# EAGLE schematic Tdog v0.9 (EAGLE 6.3)
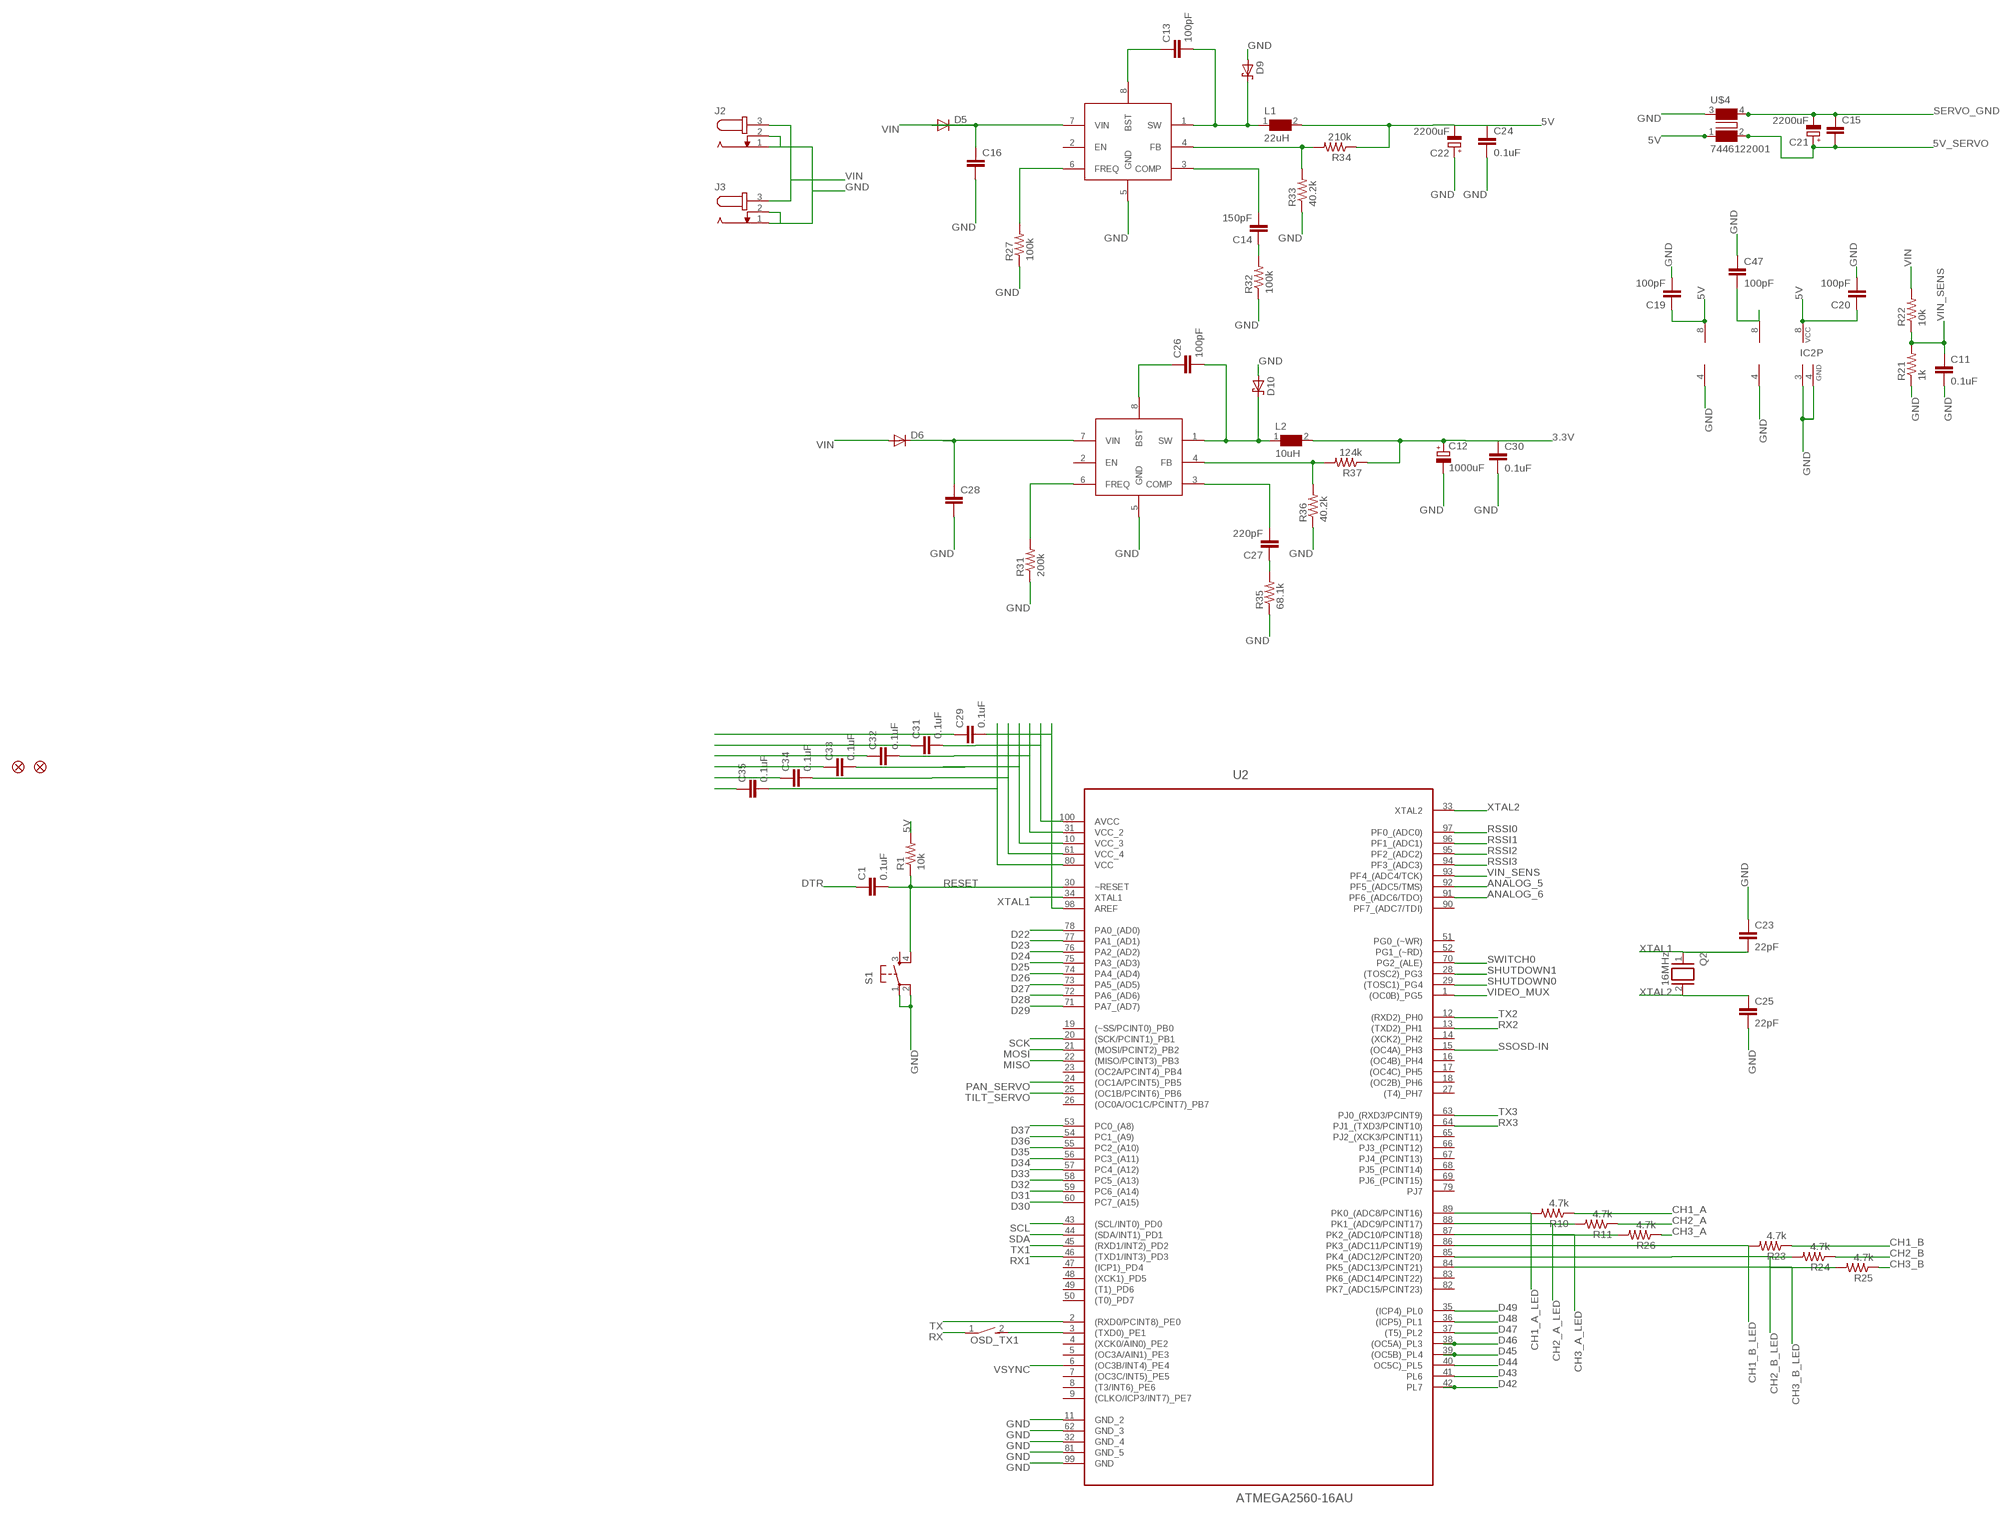
[diagram p0: schematic, sheet 1, part 1 of 3]
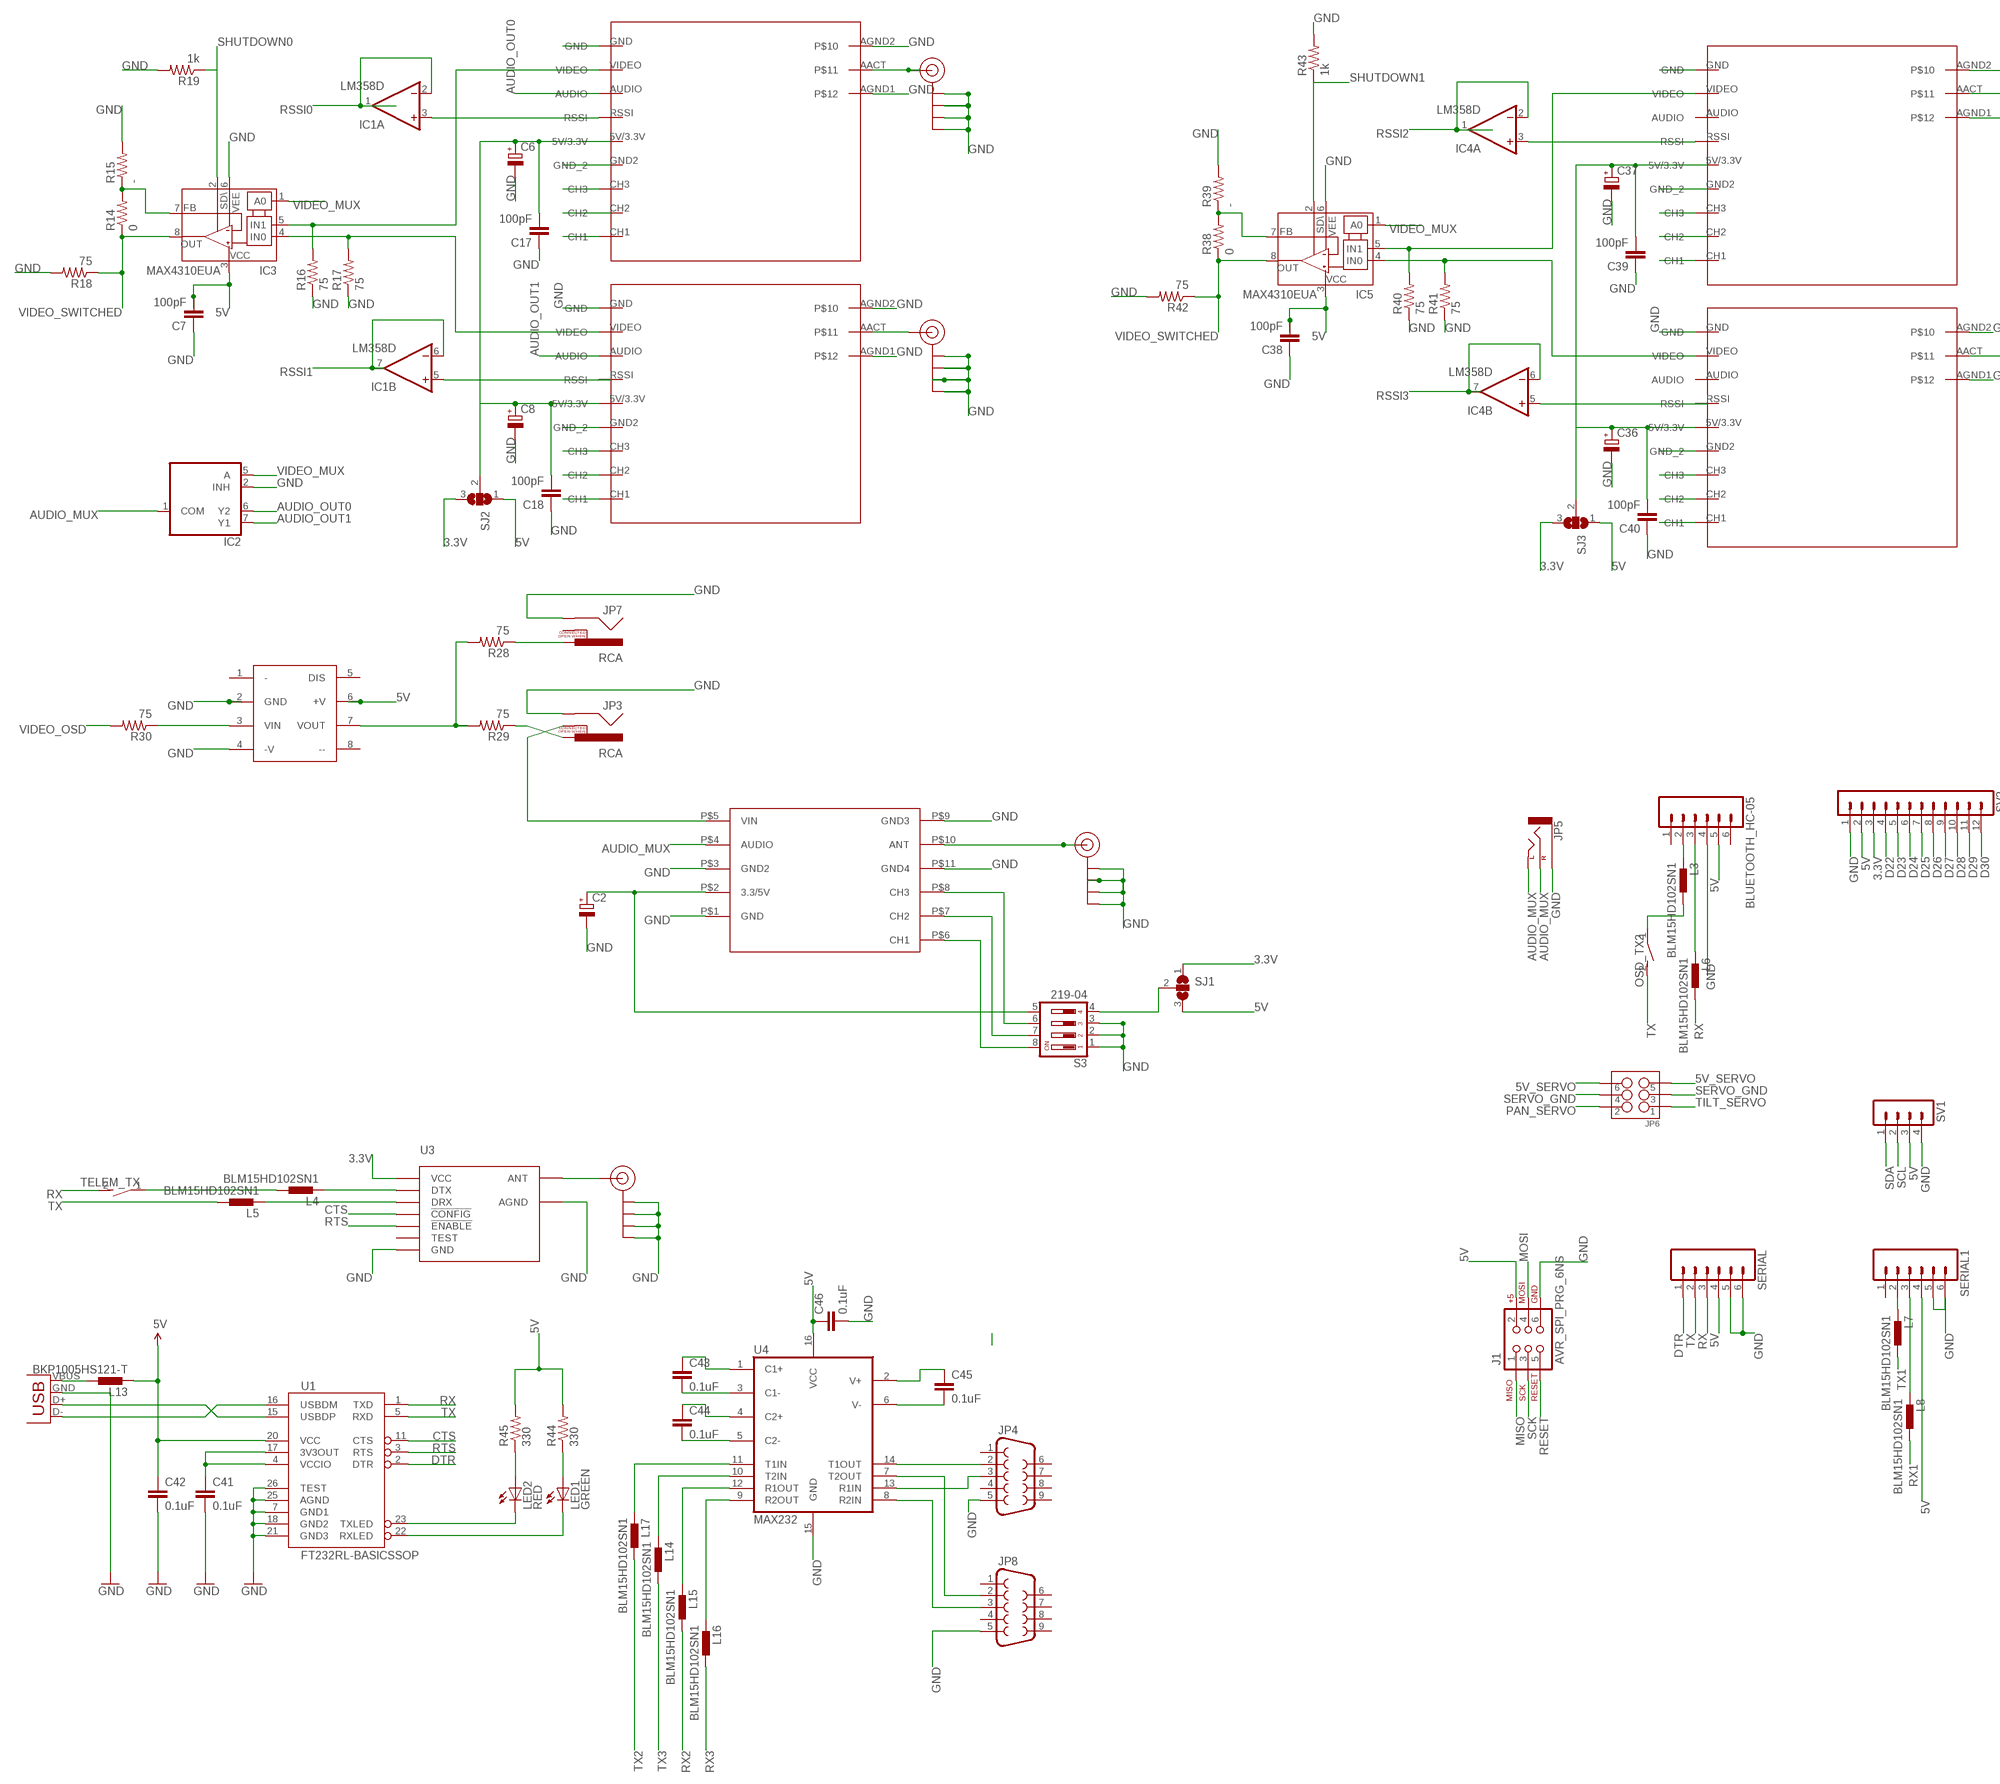
[diagram p1: schematic, sheet 1, part 2 of 3]
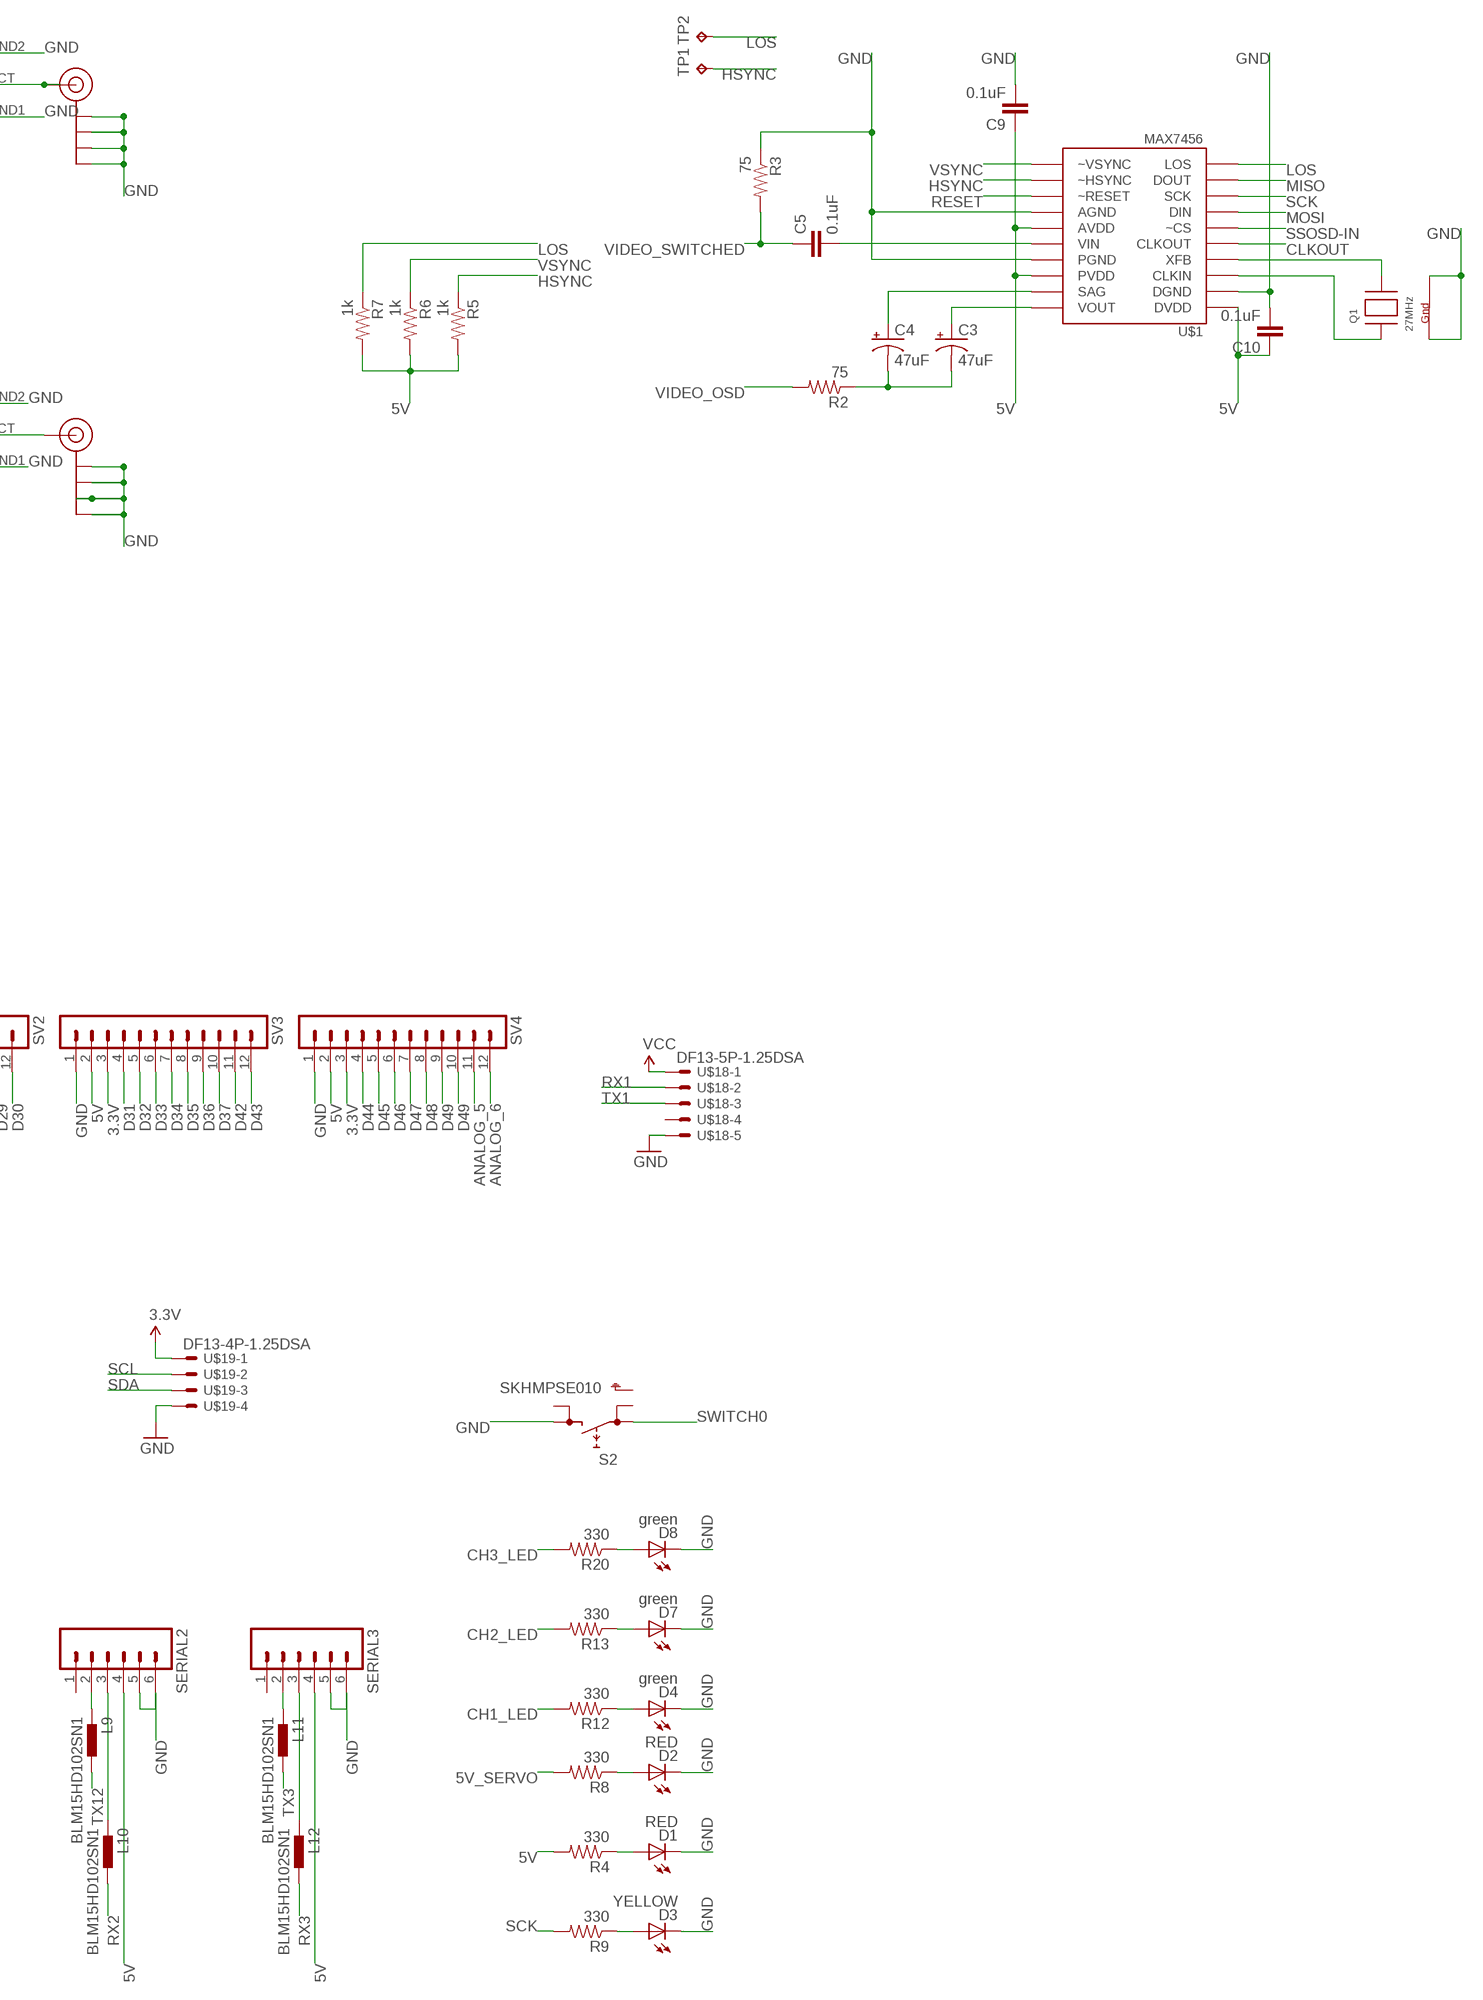
[diagram p2: schematic, sheet 1, part 3 of 3]

## Parts
BLUETOOTH_HC-05  M06SIP  [1X06]
C1  0.1uF  CAP0402-CAP  [0402-CAP]
C2  CPOL-EUE3.5-10  [E3,5-10]
C3  47uF  CAP_POL3528  [EIA3528]
C4  47uF  CAP_POL3528  [EIA3528]
C5  0.1uF  CAP0402-CAP  [0402-CAP]
C6  CPOL-EUE3.5-10  [E3,5-10]
C7  100pF  CAP0402-CAP  [0402-CAP]
C8  CPOL-EUE3.5-10  [E3,5-10]
C9  0.1uF  CAP0402-CAP  [0402-CAP]
C10  0.1uF  CAP0402-CAP  [0402-CAP]
C11  0.1uF  CAP0402-CAP  [0402-CAP]
C12  1000uF  CPOL-EUE5-10.5  [E5-10,5]
C13  100pF  CAP0402-CAP  [0402-CAP]
C14  150pF  CAP0402-CAP  [0402-CAP]
C15  C-EUC1206  [C1206]
C16  C-EUC1206  [C1206]
C17  100pF  CAP0402-CAP  [0402-CAP]
C18  100pF  CAP0402-CAP  [0402-CAP]
C19  100pF  CAP0402-CAP  [0402-CAP]
C20  100pF  CAP0402-CAP  [0402-CAP]
C21  2200uF  CPOL-EUE7.5-16  [E7,5-16]
C22  2200uF  CPOL-EUE7.5-16  [E7,5-16]
C23  22pF  CAP0402-CAP  [0402-CAP]
C24  0.1uF  CAP0402-CAP  [0402-CAP]
C25  22pF  CAP0402-CAP  [0402-CAP]
C26  100pF  CAP0402-CAP  [0402-CAP]
C27  220pF  CAP0402-CAP  [0402-CAP]
C28  C-EUC1206  [C1206]
C29  0.1uF  CAP0402-CAP  [0402-CAP]
C30  0.1uF  CAP0402-CAP  [0402-CAP]
C31  0.1uF  CAP0402-CAP  [0402-CAP]
C32  o.1uF  CAP0402-CAP  [0402-CAP]
C33  0.1uF  CAP0402-CAP  [0402-CAP]
C34  0.1uF  CAP0402-CAP  [0402-CAP]
C35  0.1uF  CAP0402-CAP  [0402-CAP]
C36  CPOL-EUE3.5-10  [E3,5-10]
C37  CPOL-EUE3.5-10  [E3,5-10]
C38  100pF  CAP0402-CAP  [0402-CAP]
C39  100pF  CAP0402-CAP  [0402-CAP]
C40  100pF  CAP0402-CAP  [0402-CAP]
C41  0.1uF  CAP0402-CAP  [0402-CAP]
C42  0.1uF  CAP0402-CAP  [0402-CAP]
C43  0.1uF  CAP0402-CAP  [0402-CAP]
C44  0.1uF  CAP0402-CAP  [0402-CAP]
C45  0.1uF  CAP0402-CAP  [0402-CAP]
C46  0.1uF  CAP0402-CAP  [0402-CAP]
C47  100pF  CAP0402-CAP  [0402-CAP]
D1  RED  LED0603  [LED-0603]
D2  RED  LED0603  [LED-0603]
D3  YELLOW  LED0603  [LED-0603]
D4  green  LED0603  [LED-0603]
D5  DIODE-DO214AA  [DO214AA]
D6  DIODE-DO214AA  [DO214AA]
D7  green  LED0603  [LED-0603]
D8  green  LED0603  [LED-0603]
D9  SCHOTTKY-DIODESMD  [SMB]
D10  SCHOTTKY-DIODESMD  [SMB]
IC1  LM358D  [SO08]
IC2  741G53DCT  [DCT_R-PDSO-G8]
IC3  MAX4310EUA  [SO08]
IC4  LM358D  [SO08]
IC5  MAX4310EUA  [SO08]
J1  AVR_SPI_PRG_6NS  [2X3-NS]
J2  JACK-PLUG1  [SPC4078]
J3  JACK-PLUG1  [SPC4078]
J$1  SMA_EDGE  [SMA-EDGE]
J$2  SMA_EDGE  [SMA-EDGE]
J$3  SMA_EDGE  [SMA-EDGE]
J$4  SMA_EDGE  [SMA-EDGE]
J$5  SMA_EDGE  [SMA-EDGE]
J$6  SMA_EDGE  [SMA-EDGE]
JP1  FIDUCIAL1X2  [FIDUCIAL-1X2]
JP2  FIDUCIAL1X2  [FIDUCIAL-1X2]
JP3  RCA  [RCA]
JP4  F09H  [F09H]
JP5  AUDIO-JACK1:1  [STEREOJACK2.5MM]
JP6  M03X2NO_SILK  [2X3-NS]
JP7  RCA  [RCA]
JP8  F09H  [F09H]
L1  22uH  WE-PD-744770112_1260/1245/1280/1210  [WE-PD_1260/1245/1280/1210]
L2  10uH  WE-PD-744770112_1260/1245/1280/1210  [WE-PD_1260/1245/1280/1210]
L3  BLM15HD102SN1  INDUCTOR-0402  [0402-IND]
L4  BLM15HD102SN1  INDUCTOR-0402  [0402-IND]
L5  BLM15HD102SN1  INDUCTOR-0402  [0402-IND]
L6  BLM15HD102SN1  INDUCTOR-0402  [0402-IND]
L7  BLM15HD102SN1  INDUCTOR-0402  [0402-IND]
L8  BLM15HD102SN1  INDUCTOR-0402  [0402-IND]
L9  BLM15HD102SN1  INDUCTOR-0402  [0402-IND]
L10  BLM15HD102SN1  INDUCTOR-0402  [0402-IND]
L11  BLM15HD102SN1  INDUCTOR-0402  [0402-IND]
L12  BLM15HD102SN1  INDUCTOR-0402  [0402-IND]
L13  BKP1005HS121-T  INDUCTOR-0402  [0402-IND]
L14  BLM15HD102SN1  INDUCTOR-0402  [0402-IND]
L15  BLM15HD102SN1  INDUCTOR-0402  [0402-IND]
L16  BLM15HD102SN1  INDUCTOR-0402  [0402-IND]
L17  BLM15HD102SN1  INDUCTOR-0402  [0402-IND]
LED1  GREEN  LED0603  [LED-0603]
LED2  RED  LED0603  [LED-0603]
OPA693  OPA693  [OPA693]
OSD_TX1  DS01E  [DS-01]
OSD_TX2  DS01E  [DS-01]
Q1  27MHz  XTAL-4-3225  [NX3225]
Q2  16MHz  XTAL/S  [QS]
R1  10k  RESISTOR0402-RES  [0402-RES]
R2  75  RESISTOR0402-RES  [0402-RES]
R3  75  RESISTOR0402-RES  [0402-RES]
R4  330  RESISTOR0402-RES  [0402-RES]
R5  1k  RESISTOR0402-RES  [0402-RES]
R6  1k  RESISTOR0402-RES  [0402-RES]
R7  1k  RESISTOR0402-RES  [0402-RES]
R8  330  RESISTOR0402-RES  [0402-RES]
R9  330  RESISTOR0402-RES  [0402-RES]
R10  4.7k  RESISTOR0402-RES  [0402-RES]
R11  4.7k  RESISTOR0402-RES  [0402-RES]
R12  330  RESISTOR0402-RES  [0402-RES]
R13  330  RESISTOR0402-RES  [0402-RES]
R14  0  RESISTOR0402-RES  [0402-RES]
R15  -  RESISTOR0402-RES  [0402-RES]
R16  75  RESISTOR0402-RES  [0402-RES]
R17  75  RESISTOR0402-RES  [0402-RES]
R18  75  RESISTOR0402-RES  [0402-RES]
R19  1k  RESISTOR0402-RES  [0402-RES]
R20  330  RESISTOR0402-RES  [0402-RES]
R21  1k  RESISTOR0402-RES  [0402-RES]
R22  10k  RESISTOR0402-RES  [0402-RES]
R23  4.7k  RESISTOR0402-RES  [0402-RES]
R24  4.7k  RESISTOR0402-RES  [0402-RES]
R25  4.7k  RESISTOR0402-RES  [0402-RES]
R26  4.7k  RESISTOR0402-RES  [0402-RES]
R27  100k  RESISTOR0402-RES  [0402-RES]
R28  75  RESISTOR0402-RES  [0402-RES]
R29  75  RESISTOR0402-RES  [0402-RES]
R30  75  RESISTOR0402-RES  [0402-RES]
R31  200k  RESISTOR0402-RES  [0402-RES]
R32  100k  RESISTOR0402-RES  [0402-RES]
R33  40.2k  RESISTOR0402-RES  [0402-RES]
R34  210k  RESISTOR0402-RES  [0402-RES]
R35  68.1k  RESISTOR0402-RES  [0402-RES]
R36  40.2k  RESISTOR0402-RES  [0402-RES]
R37  124k  RESISTOR0402-RES  [0402-RES]
R38  0  RESISTOR0402-RES  [0402-RES]
R39  -  RESISTOR0402-RES  [0402-RES]
R40  75  RESISTOR0402-RES  [0402-RES]
R41  75  RESISTOR0402-RES  [0402-RES]
R42  75  RESISTOR0402-RES  [0402-RES]
R43  1k  RESISTOR0402-RES  [0402-RES]
R44  330  RESISTOR0402-RES  [0402-RES]
R45  330  RESISTOR0402-RES  [0402-RES]
S1  TAC_SWITCHSMD  [TACTILE_SWITCH_SMD]
S2  SKHMPSE010  [SKHMPXE010]
S3  219-04  [CTS-219-04]
SERIAL  M06SIP  [1X06]
SERIAL1  M06SIP  [1X06]
SERIAL2  M06SIP  [1X06]
SERIAL3  M06SIP  [1X06]
SJ1  SJ2WW  [SJ_2W]
SJ2  SJ2WW  [SJ_2W]
SJ3  SJ2WW  [SJ_2W]
SV1  MA04-1  [MA04-1]
SV2  MA12-1  [MA12-1]
SV3  MA12-1  [MA12-1]
SV4  MA12-1  [MA12-1]
TELEM_TX  DS01E  [DS-01]
TP1  TPTP12SQ  [TP12SQ]
TP2  TPTP12SQ  [TP12SQ]
U1  FT232RL-BASICSSOP  [SSOP28DB]
U2  ATMEGA2560-16AU  [QFP50P1600X1600X120-100N]
U3  HM-TRPSMD  [HM-TRP-SMD]
U4  MAX232  MAX232SOIC16  [SO016]
U$1  MAX7456  [TSSOP28]
U$2  MP1584  [MP1584]
U$3  TX5813  [TX5813]
U$4  7446122001  [WE-LF_622/MV]
U$5  MP1584  [MP1584]
U$6  BOSCMARX5808  [BOSCAMRX5808]
U$7  BOSCMARX5808  [BOSCAMRX5808]
U$8  BOSCMARX5808  [BOSCAMRX5808]
U$10  BOSCMARX5808  [BOSCAMRX5808]
U$18  DF13-5P-1.25DSA  [DF13-5P-1.25DSA]
U$19  DF13-4P-1.25DSA  [DF13-4P-1.25DSA]
X1  USB-A-H  [USB-A-H]

## Nets
1: C36.+ C37.+ C39.2 C40.2 SJ3.2
3.3V: C12.+ C30.1 L2.2 R37.1 SJ1.1 SJ2.3 SJ3.3 SV2.3 SV3.3 SV4.3 U3.VCC U$19.1
5V: BLUETOOTH_HC-05.5 C7.2 C9.1 C10.1 C19.1 C20.1 C22.- C24.1 C29.2 C31.2 C32.2 C33.2 C34.2 C35.2 C38.2 C42.1 C46.1 C47.2 IC1.8(P:V+) IC2.8(VCC) IC3.3(V+) IC4.8(P:V+) IC5.3(V+) J1.2 L1.2 L13.P$2 OPA693.6(+V) R1.2 R4.2 R5.2 R6.2 R7.2 R34.1 R44.2 R45.2 SERIAL1.4 SERIAL2.4 SERIAL3.4 SERIAL.4 SJ1.3 SJ2.1 SJ3.1 SV1.3 SV2.2 SV3.2 SV4.2 U1.20(VCC) U2.10(VCC_3) U2.31(VCC_2) U2.61(VCC_4) U2.80(VCC) U2.98(AREF) U2.100(AVCC) U4.16(VCC) U$1.3(DVDD) U$1.21(AVDD) U$1.24(PVDD) U$4.1
5V_SERVO: C15.2 C21.+ JP6.5 JP6.6 R8.2 U$4.2
66676: C6.+ C8.+ C17.2 C18.2 SJ2.2
ANALOG_5: SV4.11 U2.92(PF5_(ADC5/TMS))
ANALOG_6: SV4.12 U2.91(PF6_(ADC6/TDO))
AUDIO_MUX: IC2.1(COM) JP5.1(LEFT) JP5.4(RIGHT) U$3.P$4(AUDIO)
AUDIO_OUT0: IC2.6(Y2)
AUDIO_OUT1: IC2.7(Y1)
CH1_A: R10.1
CH1_A_LED: R10.2 U2.89(PK0_(ADC8/PCINT16))
CH1_B: R23.1
CH1_B_LED: R23.2 U2.86(PK3_(ADC11/PCINT19))
CH1_LED: R12.2
CH2_A: R11.1
CH2_A_LED: R11.2 U2.88(PK1_(ADC9/PCINT17))
CH2_B: R24.1
CH2_B_LED: R24.2 U2.85(PK4_(ADC12/PCINT20))
CH2_LED: R13.2
CH3_A: R26.1
CH3_A_LED: R26.2 U2.87(PK2_(ADC10/PCINT18))
CH3_B: R25.1
CH3_B_LED: R25.2 U2.84(PK5_(ADC13/PCINT21))
CH3_LED: R20.2
CLKOUT: U$1.7(CLKOUT)
CTS: U1.11(CTS) U3.!CONFIG
D22: SV2.4 U2.78(PA0_(AD0))
D23: SV2.5 U2.77(PA1_(AD1))
D24: SV2.6 U2.76(PA2_(AD2))
D25: SV2.7 U2.75(PA3_(AD3))
D26: SV2.8 U2.74(PA4_(AD4))
D27: SV2.9 U2.73(PA5_(AD5))
D28: SV2.10 U2.72(PA6_(AD6))
D29: SV2.11 U2.71(PA7_(AD7))
D30: SV2.12 U2.60(PC7_(A15))
D31: SV3.4 U2.59(PC6_(A14))
D32: SV3.5 U2.58(PC5_(A13))
D33: SV3.6 U2.57(PC4_(A12))
D34: SV3.7 U2.56(PC3_(A11))
D35: SV3.8 U2.55(PC2_(A10))
D36: SV3.9 U2.54(PC1_(A9))
D37: SV3.10 U2.53(PC0_(A8))
D42: SV3.11 U2.42(PL7)
D43: SV3.12 U2.41(PL6)
D44: SV4.4 U2.40(OC5C)_PL5)
D45: SV4.5 U2.39((OC5B)_PL4)
D46: SV4.6 U2.38((OC5A)_PL3)
D47: SV4.7 U2.37((T5)_PL2)
D48: SV4.8 U2.36((ICP5)_PL1)
D49: SV4.9 SV4.10 U2.35((ICP4)_PL0)
DSFSA: C16.1 D5.C U$2.7(VIN)
DSFSA1: C28.1 D6.C U$5.7(VIN)
DTR: C1.1 SERIAL.1 U1.2(DTR)
GND: BLUETOOTH_HC-05.4 C2.- C6.- C7.1 C8.- C9.2 C10.2 C11.2 C12.- C16.2 C17.1 C18.1 C19.2 C20.2 C22.+ C23.1 C24.2 C25.2 C28.2 C29.1 C30.2 C31.1 C32.1 C33.1 C34.1 C35.1 C36.- C37.- C38.1 C39.1 C40.1 C41.2 C42.2 C46.2 C47.1 D1.C D2.C D3.C D4.C D7.C D8.C D9.A D10.A IC1.4(P:V-) IC2.2(INH) IC2.3(GND) IC2.4(GND) IC3.6(V-) IC4.4(P:V-) IC5.6(V-) J1.6 J2.1 J2.2 J3.1 J3.2 J$1.GND@0(GND) J$1.GND@1(GND) J$1.GND@2(GND) J$1.GND@3(GND) J$2.GND@0(GND) J$2.GND@1(GND) J$2.GND@2(GND) J$2.GND@3(GND) J$3.GND@0(GND) J$3.GND@1(GND) J$3.GND@2(GND) J$3.GND@3(GND) J$4.GND@0(GND) J$4.GND@1(GND) J$4.GND@2(GND) J$4.GND@3(GND) J$5.GND@0(GND) J$5.GND@1(GND) J$5.GND@2(GND) J$5.GND@3(GND) J$6.GND@0(GND) J$6.GND@1(GND) J$6.GND@2(GND) J$6.GND@3(GND) JP3.SHELL JP4.5 JP5.5(SLEEVE) JP7.SHELL JP8.5 OPA693.2(GND) OPA693.4(-V) Q1.2(G1) Q1.4(G2) R3.1 R15.2 R16.1 R17.1 R18.2 R19.2 R21.1 R27.1 R31.1 R32.1 R33.1 R35.1 R36.1 R39.2 R40.1 R41.1 R42.2 R43.2 S1.1 S1.2 S2.3(2.1) S3.1 S3.2 S3.3 SERIAL1.5 SERIAL1.6 SERIAL2.5 SERIAL2.6 SERIAL3.5 SERIAL3.6 SERIAL.5 SERIAL.6 SV1.4 SV2.1 SV3.1 SV4.1 U1.7(GND1) U1.18(GND2) U1.21(GND3) U1.25(AGND) U1.26(TEST) U2.11(GND_2) U2.32(GND_4) U2.62(GND_3) U2.81(GND_5) U2.99(GND) U3.AGND U3.GND U4.15(GND) U$1.4(DGND) U$1.20(AGND) U$1.23(PGND) U$2.5(GND) U$3.P$1(GND) U$3.P$3(GND2) U$3.P$9(GND3) U$3.P$11(GND4) U$4.3 U$5.5(GND) U$6.AGND1 U$6.AGND2 U$7.AGND1 U$7.AGND2 U$8.AGND1 U$8.AGND2 U$10.AGND1 U$10.AGND2 U$18.5 U$19.4 X1.GND(VBUS)
HSYNC: R5.1 TP1.TP U$1.18(~HSYNC)
LOS: R7.1 TP2.TP U$1.12(LOS)
MISO: J1.1 U2.22((MISO/PCINT3)_PB3) U$1.11(DOUT)
MOSI: J1.4 U2.21((MOSI/PCINT2)_PB2) U$1.9(DIN)
N$1: Q1.3(X2) U$1.6(XFB)
N$2: BLUETOOTH_HC-05.2 L3.P$2
N$3: BLUETOOTH_HC-05.3 L6.P$2
N$4: L7.P$2 SERIAL1.2
N$5: Q1.1(X1) U$1.5(CLKIN)
N$6: C3.A(+) U$1.26(VOUT)
N$7: C4.A(+) U$1.25(SAG)
N$8: C3.C(-) C4.C(-) R2.1
N$9: C5.2 U$1.22(VIN)
N$10: D1.A R4.1
N$11: D2.A R8.1
N$12: D8.A R20.1
N$13: D3.A R9.1
N$14: R31.2 U$5.6(FREQ)
N$15: JP3.PIN R29.1
N$16: S3.4 SJ1.2
N$17: R27.2 U$2.6(FREQ)
N$18: IC1.5(B:+IN)
N$19: J$3.SIG(SIGNAL) U$7.AACT
N$20: IC1.3(A:+IN)
N$21: C13.1 U$2.8(BST)
N$22: OPA693.3(VIN) R30.1
N$23: IC3.4(IN0) R17.2
N$24: OSD_TX1.2 U2.3((TXD0)_PE1)
N$25: IC3.7(FB) R14.2 R15.1
N$26: C26.1 U$5.8(BST)
N$27: OPA693.7(VOUT) R28.2 R29.2
N$28: C2.+ S3.5 U$3.P$2(3.3/5V)
N$29: J$2.SIG(SIGNAL) U$10.AACT
N$30: R33.2 R34.2 U$2.4(FB)
N$31: C14.2 U$2.3(COMP)
N$32: R36.2 R37.2 U$5.4(FB)
N$33: J$4.SIG(SIGNAL) U$3.P$10(ANT)
N$34: C14.1 R32.2
N$35: IC3.5(IN1) R16.2
N$36: IC4.5(B:+IN)
N$37: C27.2 U$5.3(COMP)
N$38: S3.6 U$3.P$8(CH3)
N$39: S3.7 U$3.P$7(CH2)
N$40: S3.8 U$3.P$6(CH1)
N$41: D4.A R12.1
N$42: D7.A R13.1
N$43: C27.1 R35.2
N$44: C26.2 D10.C L2.1 U$5.1(SW)
N$45: JP7.PIN R28.1
N$46: IC4.3(A:+IN)
N$47: C13.2 D9.C L1.1 U$2.1(SW)
N$48: IC5.4(IN0) R41.2
N$49: IC5.5(IN1) R40.2
N$50: IC5.7(FB) R38.2 R39.1
N$51: J$1.SIG(SIGNAL) U3.ANT
N$52: L4.P$1 TELEM_TX.1
N$53: L9.P$2 SERIAL2.2
N$54: J$6.SIG(SIGNAL) U$6.AACT
N$55: J$5.SIG(SIGNAL) U$8.AACT
N$56: L10.P$2 SERIAL2.3
N$57: L8.P$2 SERIAL1.3
N$58: L11.P$2 SERIAL3.2
N$59: L4.P$2 U3.DTX
N$60: L5.P$2 U3.DRX
N$61: L12.P$2 SERIAL3.3
N$62: C41.1 U1.4(VCCIO) U1.17(3V3OUT)
N$63: U1.15(USBDP) X1.D+(D-)
N$64: U1.16(USBDM) X1.D-(D+)
N$65: LED2.A R45.1
N$66: LED1.A R44.1
N$67: LED2.C U1.23(TXLED)
N$68: LED1.C U1.22(RXLED)
N$69: L13.P$1 X1.VBUS(GND)
N$70: L3.P$1 OSD_TX2.1
N$71: C45.1 U4.2(V+)
N$72: C45.2 U4.6(V-)
N$73: C44.1 U4.4(C2+)
N$74: C44.2 U4.5(C2-)
N$75: C43.1 U4.1(C1+)
N$76: JP4.3 U4.13(R1IN)
N$77: JP4.2 U4.14(T1OUT)
N$78: C43.2 U4.3(C1-)
N$80: L17.P$2 U4.11(T1IN)
N$81: L14.P$2 U4.10(T2IN)
N$82: L15.P$2 U4.12(R1OUT)
N$83: L16.P$2 U4.9(R2OUT)
N$84: JP8.2 U4.7(T2OUT)
N$85: JP8.3 U4.8(R2IN)
PAN_SERVO: JP6.2 U2.24((OC1A/PCINT5)_PB5)
RESET: C1.2 J1.5 R1.1 S1.4 U2.30(~RESET) U$1.19(~RESET)
RSSI0: IC1.1(A:OUT) IC1.2(A:-IN) U2.97(PF0_(ADC0))
RSSI1: IC1.6(B:-IN) IC1.7(B:OUT) U2.96(PF1_(ADC1))
RSSI2: IC4.1(A:OUT) IC4.2(A:-IN) U2.95(PF2_(ADC2))
RSSI3: IC4.6(B:-IN) IC4.7(B:OUT) U2.94(PF3_(ADC3))
RTS: U1.3(RTS) U3.!ENABLE
RX: L6.P$1 OSD_TX1.1 SERIAL.3 TELEM_TX.2 U1.1(TXD)
RX1: L8.P$1 U2.46((TXD1/INT3)_PD3) U$18.2
RX2: L10.P$1 L15.P$1 U2.13((TXD2)_PH1)
RX3: L12.P$1 L16.P$1 U2.64(PJ1_(TXD3/PCINT10))
SCK: J1.3 R9.2 U2.20((SCK/PCINT1)_PB1) U$1.10(SCK)
SCL: SV1.2 U2.43((SCL/INT0)_PD0) U$19.2
SDA: SV1.1 U2.44((SDA/INT1)_PD1) U$19.3
SERVO_GND: C15.1 C21.- JP6.3 JP6.4 U$4.4
SHUTDOWN0: IC3.2(!SHDN) R19.1 U2.29((TOSC1)_PG4)
SHUTDOWN1: IC5.2(!SHDN) R43.1 U2.28((TOSC2)_PG3)
SSOSD-IN: U2.15((OC4A)_PH3) U$1.8(~CS)
SWITCH0: S2.1(1.1) U2.70(PG2_(ALE))
TILT_SERVO: JP6.1 U2.25((OC1B/PCINT6)_PB6)
TX: L5.P$1 OSD_TX2.2 SERIAL.2 U1.5(RXD) U2.2((RXD0/PCINT8)_PE0)
TX1: L7.P$1 U2.45((RXD1/INT2)_PD2) U$18.3
TX2: L17.P$1 U2.12((RXD2)_PH0)
TX3: L11.P$1 L14.P$1 U2.63(PJ0_(RXD3/PCINT9))
TX12: L9.P$1
VCC: U$18.1
VIDEO_MUX: IC2.5(A) IC3.1(A0) IC5.1(A0) U2.1((OC0B)_PG5)
VIDEO_OSD: R2.2 R30.2
VIDEO_SWITCHED: C5.1 IC3.8(OUT) IC5.8(OUT) R3.2 R14.1 R18.1 R38.1 R42.1
VIDEO_TX: JP3.SWITCH U$3.P$5(VIN)
VIN: D5.A D6.A J2.3 J3.3 R22.2
VIN_SENS: C11.1 R21.2 R22.1 U2.93(PF4_(ADC4/TCK))
VSYNC: R6.1 U2.6((OC3B/INT4)_PE4) U$1.17(~VSYNC)
XTAL1: C23.2 Q2.1 U2.34(XTAL1)
XTAL2: C25.1 Q2.2 U2.33(XTAL2)
Unconnected: BLUETOOTH_HC-05.1 BLUETOOTH_HC-05.6 JP4.1 JP4.4 JP4.6 JP4.7 JP4.8 JP4.9 JP7.SWITCH JP8.1 JP8.4 JP8.6 JP8.7 JP8.8 JP8.9 OPA693.1(-) OPA693.5(DIS) OPA693.8(--) S1.3 S2.2(1.2) S2.4(2.2) S2.5(SH) SERIAL1.1 SERIAL2.1 SERIAL3.1 U2.4((XCK0/AIN0)_PE2) U2.5((OC3A/AIN1)_PE3) U2.7((OC3C/INT5)_PE5) U2.8((T3/INT6)_PE6) U2.9((CLKO/ICP3/INT7)_PE7) U2.14((XCK2)_PH2) U2.16((OC4B)_PH4) U2.17((OC4C)_PH5) U2.18((OC2B)_PH6) U2.19((~SS/PCINT0)_PB0) U2.23((OC2A/PCINT4)_PB4) U2.26((OC0A/OC1C/PCINT7)_PB7) U2.27((T4)_PH7) U2.47((ICP1)_PD4) U2.48((XCK1)_PD5) U2.49((T1)_PD6) U2.50((T0)_PD7) U2.51(PG0_(~WR)) U2.52(PG1_(~RD)) U2.65(PJ2_(XCK3/PCINT11)) U2.66(PJ3_(PCINT12)) U2.67(PJ4_(PCINT13)) U2.68(PJ5_(PCINT14)) U2.69(PJ6_(PCINT15)) U2.79(PJ7) U2.82(PK7_(ADC15/PCINT23)) U2.83(PK6_(ADC14/PCINT22)) U2.90(PF7_(ADC7/TDI)) U3.TEST U$2.2(EN) U$5.2(EN) U$6.AUDIO U$6.CH1 U$6.CH2 U$6.CH3 U$6.RSSI U$6.VIDEO U$7.AUDIO U$7.CH1 U$7.CH2 U$7.CH3 U$7.RSSI U$7.VIDEO U$8.AUDIO U$8.CH1 U$8.CH2 U$8.CH3 U$8.RSSI U$8.VIDEO U$10.AUDIO U$10.CH1 U$10.CH2 U$10.CH3 U$10.RSSI U$10.VIDEO U$18.4

## Power pins joined to a net without a drawn wire
5V/3.3V: U$6.5V/3.3V U$7.5V/3.3V U$8.5V/3.3V U$10.5V/3.3V
GND: U$6.GND U$7.GND U$8.GND U$10.GND
GND_2: U$6.GND2(GND_2) U$7.GND2(GND_2) U$8.GND2(GND_2) U$10.GND2(GND_2)

## Library data of the parts
BLUETOOTH_HC-05 SERIAL SERIAL1-SERIAL3 = SparkFun:M06: Header 6 Standard 6-pin 0.1" header. Use with straight break away headers (SKU : PRT-00116), right angle break away headers (PRT-00553), swiss pins (PRT-00743), machine pins (PRT-00117), and female headers (PRT-00115). Molex polarized connector foot print use with SKU : PRT-08094 with associated crimp pins and housings. NOTES ON THE VARIANTS LOCK and LOCK_LONGPADS... This footprint was designed to help hold the alignment of a through-hole component (i.e. 6-pin header) while soldering it into place. You may notice that each hole has been shifted either up or down by 0.005 of an inch from it's more standard position (which is a perfectly straight line). This slight alteration caused the pins (the squares in the middle) to touch the edges of the holes. Because they are alternating, it causes a "brace" to hold the component in place. 0.005 has proven to be the perfect amount of "off-center" position when using our standard breakaway headers. Although looks a little odd when you look at the bare footprint, once you have a header in there, the alteration is very hard to notice. Also, if you push a header all the way into place, it is covered up entirely on the bottom side. This idea of altering the position of holes to aid alignment will be further integrated into the Sparkfun Library for other footprints. It can help hold any component with 3 or more connection pins.
C1 C5 C7 C9-C11 C13 C14 C17-C20 C23-C27 C29-C35 C38-C47 = SparkFun:CAP: Capacitor Standard 0603 ceramic capacitor, and 0.1" leaded capacitor.
C2 C6 C8 C12 C21 C22 C36 C37 = rcl:CPOL-EU: POLARIZED CAPACITOR, European symbol
C3 C4 = SparkFun:CAP_POL: Capacitor Polarized These are standard SMD and PTH capacitors. Normally 10uF, 47uF, and 100uF in electrolytic and tantalum varieties. Always verify the external diameter of the through hole cap, it varies with capacity, voltage, and manufacturer. The EIA devices should be standard.
C15 C16 C28 = rcl:C-EU: CAPACITOR, European symbol
D1-D4 D7 D8 LED1 LED2 = SparkFun:LED: LEDs Standard schematic elements and footprints for 5mm, 3mm, 1206, and 0603 sized LEDs. 5mm - Spark Fun Electronics SKU : COM-00529 (and others)
D5 D6 = diode:DIODE-: DIODE
D9 D10 = diode:SCHOTTKY-DIODE: Schottky Diode
IC1 IC4 = linear:LM358: OP AMP also LM158; LM258; LM2904 Source: http://cache.national.com/ds/LM/LM158.pdf
IC2 = 74xx-little-de:74*1G53: SINGLE-POLE DOUBLE-THROW (SPDT) ANALOG SWITCH 2:1 ANALOG MULTIPLEXER/DEMULTIPLEXER Source: http://focus.ti.com/lit/ds/symlink/sn74lvc2g53.pdf
IC3 IC5 = maxim:MAX4310: Video Multiplexer-Amplifier High-Speed, Low-Power, Single-Supply, Multichannel; OC_FARNELL: unknown; OC_NEWARK: unknown
J1 = SparkFun:AVR_SPI_PRG_6: AVR ISP 6 Pin This is the reduced ISP connector for AVR programming. Common on Arduino. This footprint will take up less PCB space and can be used with a 10-pin to 6-pin adapter such as SKU: BOB-08508
J2 J3 = con-jack:JACK-PLUG: DC POWER JACK Power Jack, DC, Right Angle, Through Hole, Rated 5A at 16VDC, PC Terminals Distributor: Farnell (www.Farnell.de) Drawing: 84N1161.pdf / 84N1162.pdf Manufacturer: SPC Technology (www.spctechnology.com) Type: SPC4077 / SPC 4078; OC_FARNELL: unknown; OC_NEWARK: unknown
J$1-J$6 = 3DRobotics:SMA_EDGE: SMA Antenna Connector End launch SMA connector. The paste layer has been removed so that the connector can be hand soldered onto the board after reflow.
JP1 JP2 = SparkFun:FIDUCIAL: Fiducial Alignment Points Various fiducial points for machine vision alignment.
JP3 JP7 = SparkFun-Connectors:RCA
JP4 JP8 = con-subd:F09: SUB-D; OC_FARNELL: unknown; OC_NEWARK: unknown
JP5 = SparkFun-Connectors:AUDIO-JACK: 3.5mm Audio Jack Simple 3.5mm common PCB mount audio jack. SKU: PRT-08032
JP6 = SparkFun-Connectors:M03X2: 2x3 .1" header. Shrouded, with keying- CONN-10681 SMT- CONN-11415 Pogo pins- HW-11044
L1 L2 = WE-PD:WE-PD: SMD-Shielded Power Inductors WE-PD - Magnetically shielded version which results in a low leakage field - High storage capacity - Low self-losses - Highest possible current loading for SMD-Inducors -- Switching regulators with low operating voltages (computer, laptop, mobile phones, pagers) -- Integrated DC/DC-converter -- Is recommended for the application with switching regulators from National Semiconductor, Linear Technology, Texas Instruments and Fairchild Semiconductor, ect. -- Graphic cards -- Plastic base: Because of the one piece construction these are more suitable for high vibration or shock applications; MPN: 744770112; OC_FARNELL: 2082593; OC_NEWARK: 88T7065; PACKAGE: 1280; SUPPLIER: Wuerth Elektronik
L3-L17 = pel_dipol_comp:INDUCTOR
OPA693 = opa693:OPA693
OSD_TX1 OSD_TX2 TELEM_TX = switch-dil:DS01E: DIL/CODE SWITCH; OC_FARNELL: unknown; OC_NEWARK: unknown
Q1 = adafruit:XTAL-4: Classic 4-pin 3.2 x 2.5mm crystal
Q2 = special:XTAL/S: CRYSTAL
R1-R45 = SparkFun:RESISTOR: Resistor Basic schematic elements and footprints for 0603, 1206, and PTH resistors.
S1 = SparkFun:TAC_SWITCH: Momentary Switch Button commonly used for reset or general input. Spark Fun Electronics SKU : COM-00097
S2 = switch:SKHMP*E010: 6.2 X 6.5mm TACT Switch (SMD) Source: http://www3.alps.co.jp/WebObjects/catalog.woa/PDF/E/Switch/Tact/SKHM/SKHM.PDF
S3 = switch-dil:219-04*: Surface Mount DIP Switch Series 219 SMT CTS Electronic Components Sourc: www.ctscorp.com; OC_FARNELL: unknown; OC_NEWARK: unknown
SJ1-SJ3 = jumper:SJ2W: SMD solder JUMPER
SV1 = con-lstb:MA04-1: PIN HEADER; OC_FARNELL: unknown; OC_NEWARK: unknown
SV2-SV4 = con-lstb:MA12-1: PIN HEADER; OC_FARNELL: unknown; OC_NEWARK: unknown
TP1 TP2 = testpad:TP: Test pad
U1 = SparkFun:FT232RL-BASIC: USB UART This is the simplified version of the FT232RL unit. Only what you need, nothing you don't. Spark Fun Electronics SKU : COM-00650
U2 = Atmel_By_element14_Batch_1-00:ATMEGA2560-16AU: Microcontroller; DESCRIPTION: Microcontroller; MPN: ATMEGA2560-16AU; OC_FARNELL: 1288330; OC_NEWARK: 23M5051; PACKAGE: LQFP-100; SUPPLIER: ATMEL
U3 = 3DRobotics:HM-TRP: HM-TRP Series 100mW Transceiver module HM-TRP series is a low cost, high performance transparent FSK transceiver with operating at 433/470/868/915 MHz. It features small size, high output power, high sensitivity, long transmission distance and high communication data rate with auto set up for communication change and data receiving and transmission control. There is UART interface, it is easy to realize the wireless data transmission with only providing the UART data. It is flexible for the users to set the UART baud rate, frequency, output power, data rate, frequency deviation, receiving bandwidth etc parameters. It is your ideal choice for designing wireless data transmission products which can be widely used on wireless data transmission field.
U4 = SparkFun:MAX232: RS232 Transceiver Very common IC. This is generically called 'MAX232', but works with the 3V equivalent MAX3232 generic ICs. Field tested and mother approved. Spark Fun Electronics SKU : IC-3232-DIP and IC-3232-SMD
U$1 = SparkFun:MAX7456
U$2 U$5 = MPS:MP1584
U$3 = boscam:TX5813
U$4 = WE-LF:7446122001
U$6-U$8 U$10 = boscam:BOSCMARX5808
U$18 = pixhawk2:DF13-5P-1.25?
U$19 = pixhawk2:DF13-4P-1.25?
X1 = SparkFun:USB: USB Connectors USB-B-PTH is fully proven SKU : PRT-00139 USB-miniB is fully proven SKU : PRT-00587 USB-A-PCB is untested. USB-A-H is throughly reviewed, but untested. Spark Fun Electronics SKU : PRT-00437 USB-B-SMT is throughly reviewed, but untested. Needs silkscreen touching up. USB-A-S has not been used/tested USB-MB-H has not been used/tested

## Net classes
0 default: width 0.254 mm